# EAGLE design FlightController3 (EAGLE 8.4.0)

## Sheet 1 of 4: Main
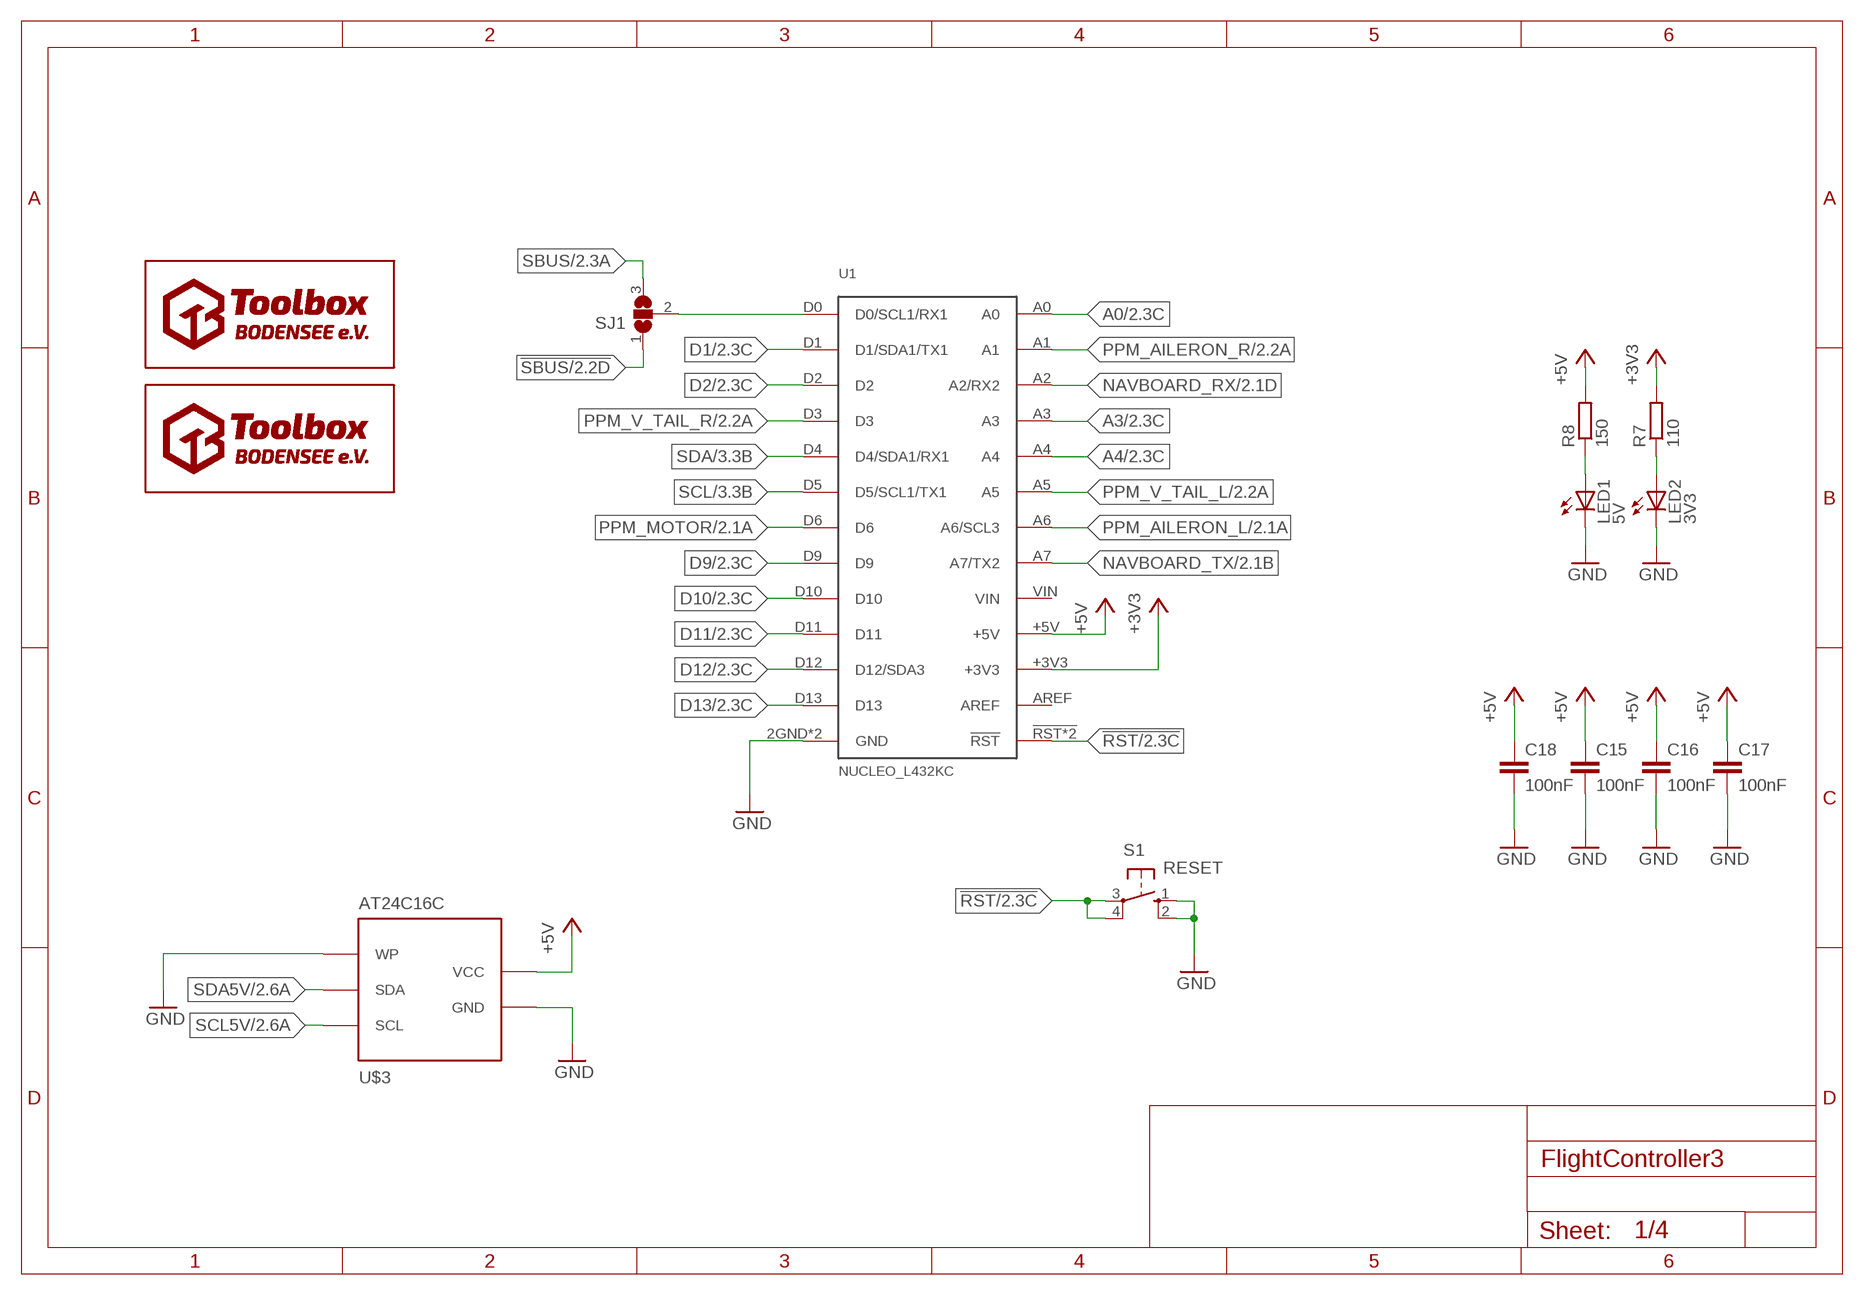
[diagram p0: schematic, sheet 1]

### Parts
C15  100nF  C-EUC1206  [C1206]
C16  100nF  C-EUC1206  [C1206]
C17  100nF  C-EUC1206  [C1206]
C18  100nF  C-EUC1206  [C1206]
LED1  5V  LEDSML0603  [SML0603]
LED2  3V3  LEDSML0603  [SML0603]
R7  110  R-EU_M1206  [M1206]
R8  150  R-EU_M1206  [M1206]
S1  RESET  10-XX  [B3F-10XX]
SJ1  SJ2W  [SJ_2]
U1  NUCLEO_L432KC  [NUCLEO]
U$1  TOOLBOX_LOGO  [TOOLBOX]
U$2  TOOLBOX_LOGO  [TOOLBOX]
U$3  AT24C16C  [DIL08]

### Nets
!RST: S1.3(P) S1.4(P1) U1.2!RST(!RST) U1.!RST ; also sheet 2
!SBUS: SJ1.1 ; also sheet 2,3
+3V3: R7.2 U1.+3V3 ; also sheet 2,3
+5V: C15.1 C16.1 C17.1 C18.1 R8.2 U1.+5V U$3.8(VCC) ; also sheet 2,3,4
A0: U1.A0 ; also sheet 2
A3: U1.A3 ; also sheet 2
A4: U1.A4 ; also sheet 2
D1: U1.D1(D1/SDA1/TX1) ; also sheet 2
D2: U1.D2 ; also sheet 2
D9: U1.D9 ; also sheet 2
D10: U1.D10 ; also sheet 2
D11: U1.D11 ; also sheet 2
D12: U1.D12(D12/SDA3) ; also sheet 2
D13: U1.D13 ; also sheet 2
GND: C15.2 C16.2 C17.2 C18.2 LED1.C LED2.C S1.1(S) S1.2(S1) U1.2GND(GND) U1.GND U$3.4(GND) U$3.7(WP) ; also sheet 2,3,4
N$2: LED2.A R7.1
N$3: LED1.A R8.1
N$10: SJ1.2 U1.D0(D0/SCL1/RX1)
NAVBOARD_RX: U1.A2(A2/RX2) ; also sheet 2
NAVBOARD_TX: U1.A7(A7/TX2) ; also sheet 2
PPM_AILERON_L: U1.A6(A6/SCL3) ; also sheet 2
PPM_AILERON_R: U1.A1 ; also sheet 2
PPM_MOTOR: U1.D6 ; also sheet 2
PPM_V_TAIL_L: U1.A5 ; also sheet 2
PPM_V_TAIL_R: U1.D3 ; also sheet 2
SBUS: SJ1.3 ; also sheet 2,3
SCL: U1.D5(D5/SCL1/TX1) ; also sheet 3
SCL5V: U$3.6(SCL) ; also sheet 2,3,4
SDA: U1.D4(D4/SDA1/RX1) ; also sheet 3
SDA5V: U$3.5(SDA) ; also sheet 2,3,4
Unconnected: U1.AREF

## Sheet 2 of 4: Connectors
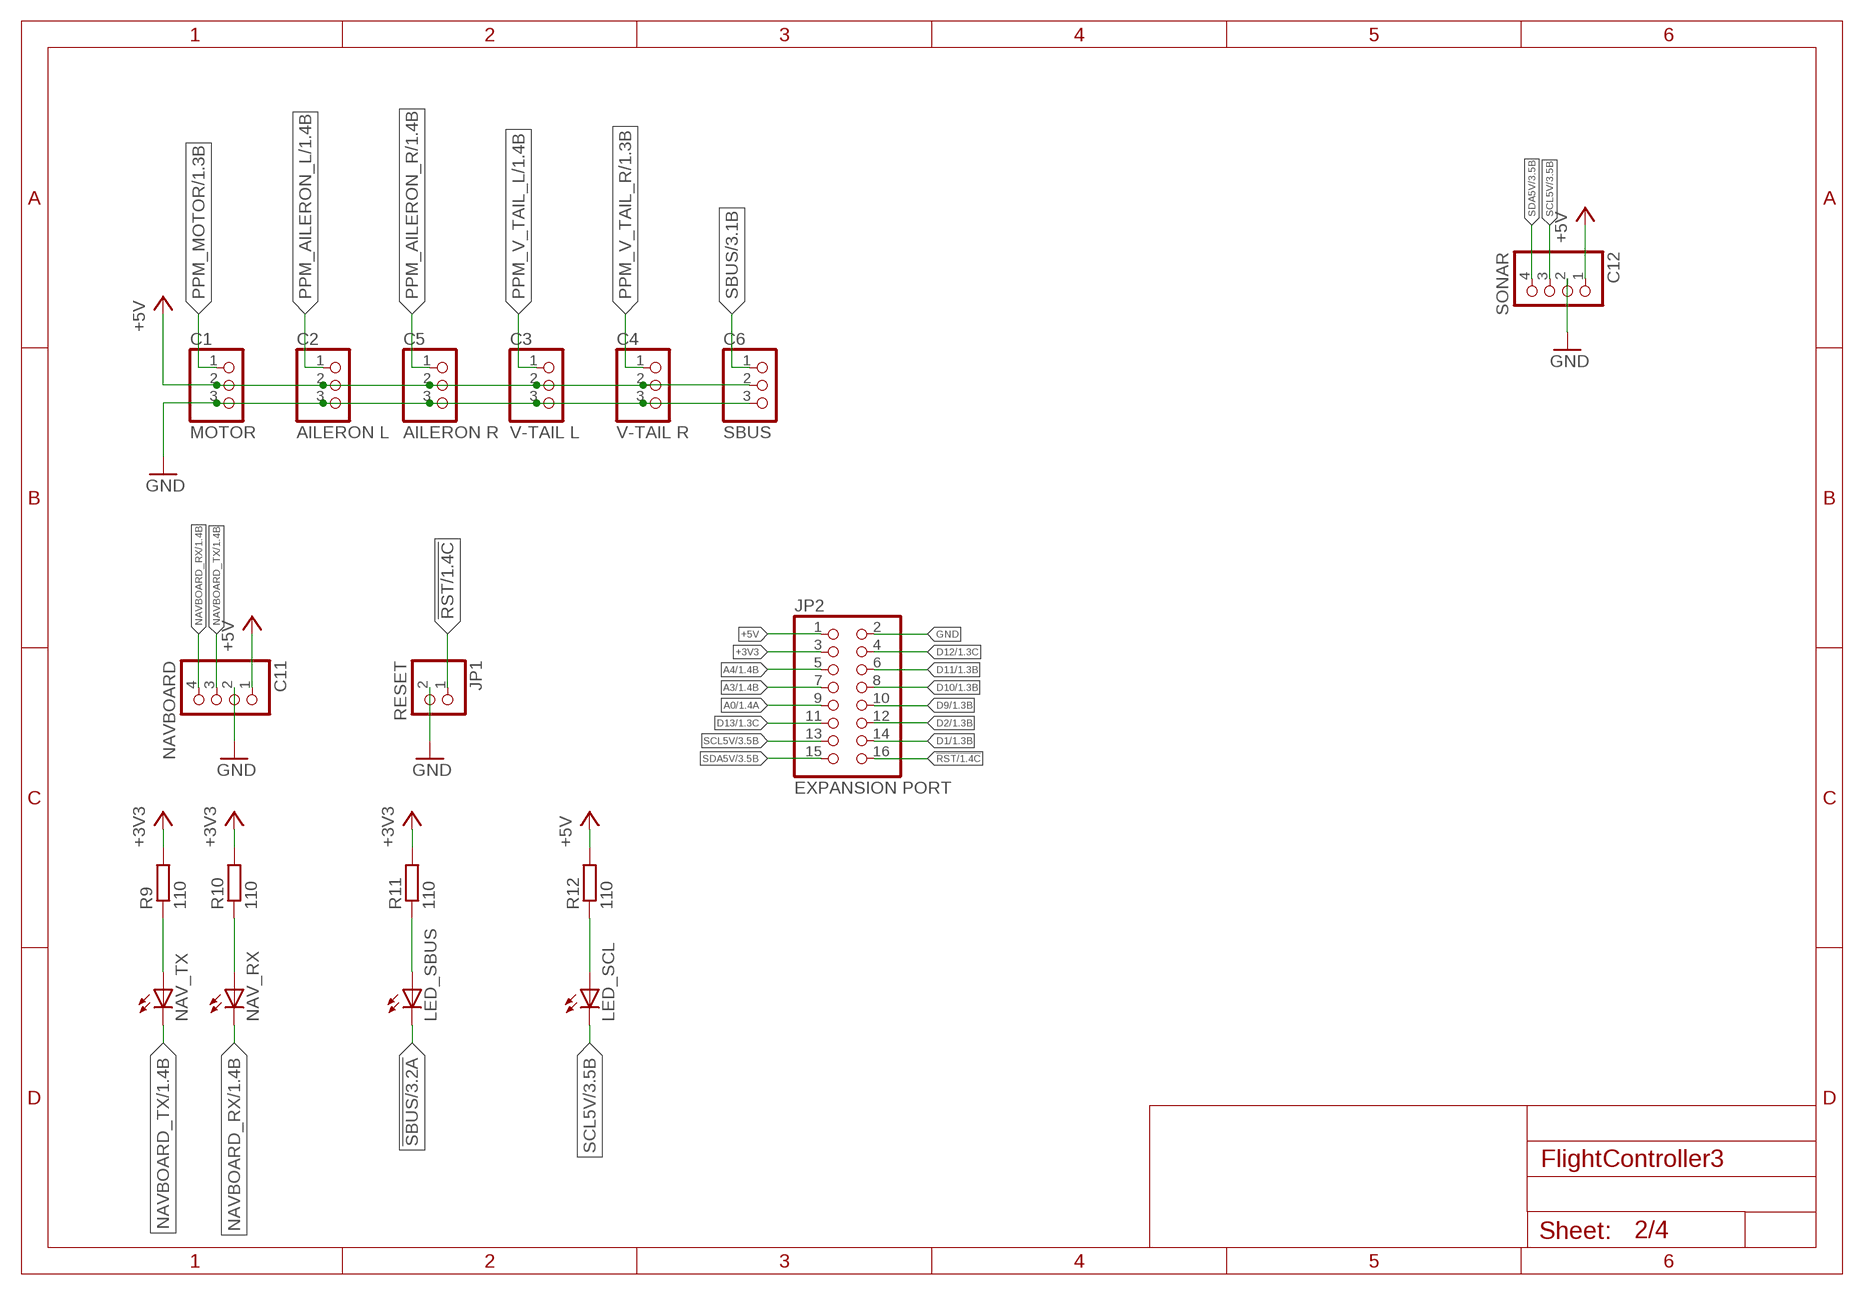
[diagram p1: schematic, sheet 2]

### Parts
C1  MOTOR  PINHD-1X3  [1X03]
C2  AILERON L  PINHD-1X3  [1X03]
C3  V-TAIL L  PINHD-1X3  [1X03]
C4  V-TAIL R  PINHD-1X3  [1X03]
C5  AILERON R  PINHD-1X3  [1X03]
C6  SBUS  PINHD-1X3  [1X03]
C11  NAVBOARD  PINHD-1X4  [1X04]
C12  SONAR  PINHD-1X4  [1X04]
JP1  RESET  PINHD-1X2  [1X02]
JP2  EXPANSION PORT  PINHD-2X8  [2X08]
LED_SBUS  LEDSML0603  [SML0603]
LED_SCL  LEDSML0603  [SML0603]
NAV_RX  LEDSML0603  [SML0603]
NAV_TX  LEDSML0603  [SML0603]
R9  110  R-EU_M1206  [M1206]
R10  110  R-EU_M1206  [M1206]
R11  110  R-EU_M1206  [M1206]
R12  110  R-EU_M1206  [M1206]

### Nets
!RST: JP1.1 JP2.16 ; also sheet 1
!SBUS: LED_SBUS.C ; also sheet 1,3
+3V3: JP2.3 R9.2 R10.2 R11.2 ; also sheet 1,3
+5V: C1.2 C2.2 C3.2 C4.2 C5.2 C6.2 C11.1 C12.1 JP2.1 R12.2 ; also sheet 1,3,4
A0: JP2.9 ; also sheet 1
A3: JP2.7 ; also sheet 1
A4: JP2.5 ; also sheet 1
D1: JP2.14 ; also sheet 1
D2: JP2.12 ; also sheet 1
D9: JP2.10 ; also sheet 1
D10: JP2.8 ; also sheet 1
D11: JP2.6 ; also sheet 1
D12: JP2.4 ; also sheet 1
D13: JP2.11 ; also sheet 1
GND: C1.3 C2.3 C3.3 C4.3 C5.3 C6.3 C11.2 C12.2 JP1.2 JP2.2 ; also sheet 1,3,4
N$4: NAV_TX.A R9.1
N$5: NAV_RX.A R10.1
N$6: LED_SBUS.A R11.1
N$7: LED_SCL.A R12.1
NAVBOARD_RX: C11.4 NAV_RX.C ; also sheet 1
NAVBOARD_TX: C11.3 NAV_TX.C ; also sheet 1
PPM_AILERON_L: C2.1 ; also sheet 1
PPM_AILERON_R: C5.1 ; also sheet 1
PPM_MOTOR: C1.1 ; also sheet 1
PPM_V_TAIL_L: C3.1 ; also sheet 1
PPM_V_TAIL_R: C4.1 ; also sheet 1
SBUS: C6.1 ; also sheet 1,3
SCL5V: C12.3 JP2.13 LED_SCL.C ; also sheet 1,3,4
SDA5V: C12.4 JP2.15 ; also sheet 1,3,4

## Sheet 3 of 4: Signal
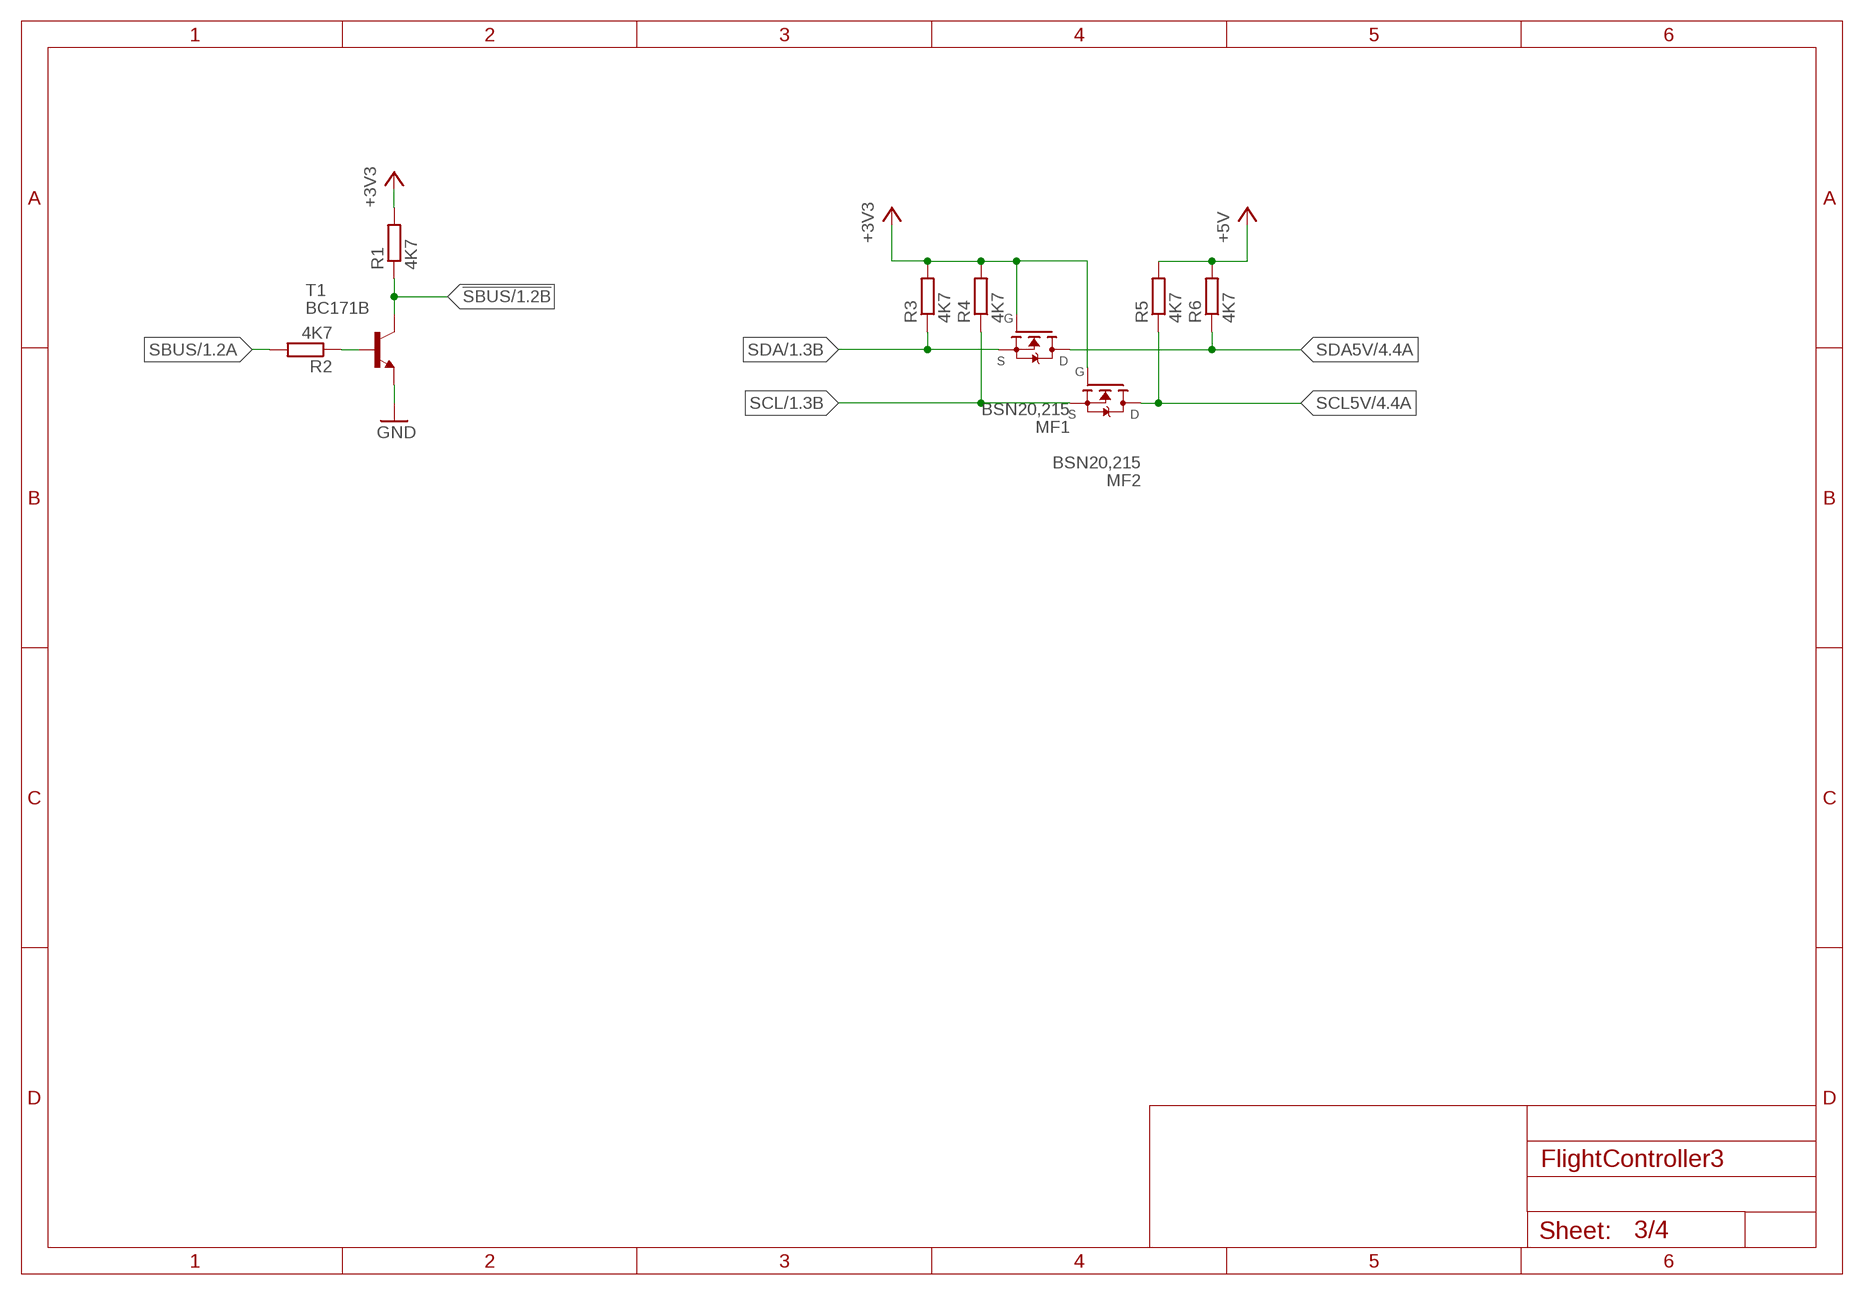
[diagram p2: schematic, sheet 3]

### Parts
MF1  BSN20,215  [BSN20_215]
MF2  BSN20,215  [BSN20_215]
R1  4K7  R-EU_R0603  [R0603]
R2  4K7  R-EU_R0603  [R0603]
R3  4K7  R-EU_R0603  [R0603]
R4  4K7  R-EU_R0603  [R0603]
R5  4K7  R-EU_R0603  [R0603]
R6  4K7  R-EU_R0603  [R0603]
T1  BC171B  -NPN-TO92  [TO92]

### Nets
!SBUS: R1.1 T1.3(C) ; also sheet 1,2
+3V3: MF1.1(G) MF2.1(G) R1.2 R3.2 R4.2 ; also sheet 1,2
+5V: R5.2 R6.2 ; also sheet 1,2,4
GND: T1.1(E) ; also sheet 1,2,4
N$1: R2.1 T1.2(B)
SBUS: R2.2 ; also sheet 1,2
SCL: MF2.2(S) R4.1 ; also sheet 1
SCL5V: MF2.3(D) R5.1 ; also sheet 1,2,4
SDA: MF1.2(S) R3.1 ; also sheet 1
SDA5V: MF1.3(D) R6.1 ; also sheet 1,2,4

## Sheet 4 of 4: Sensors
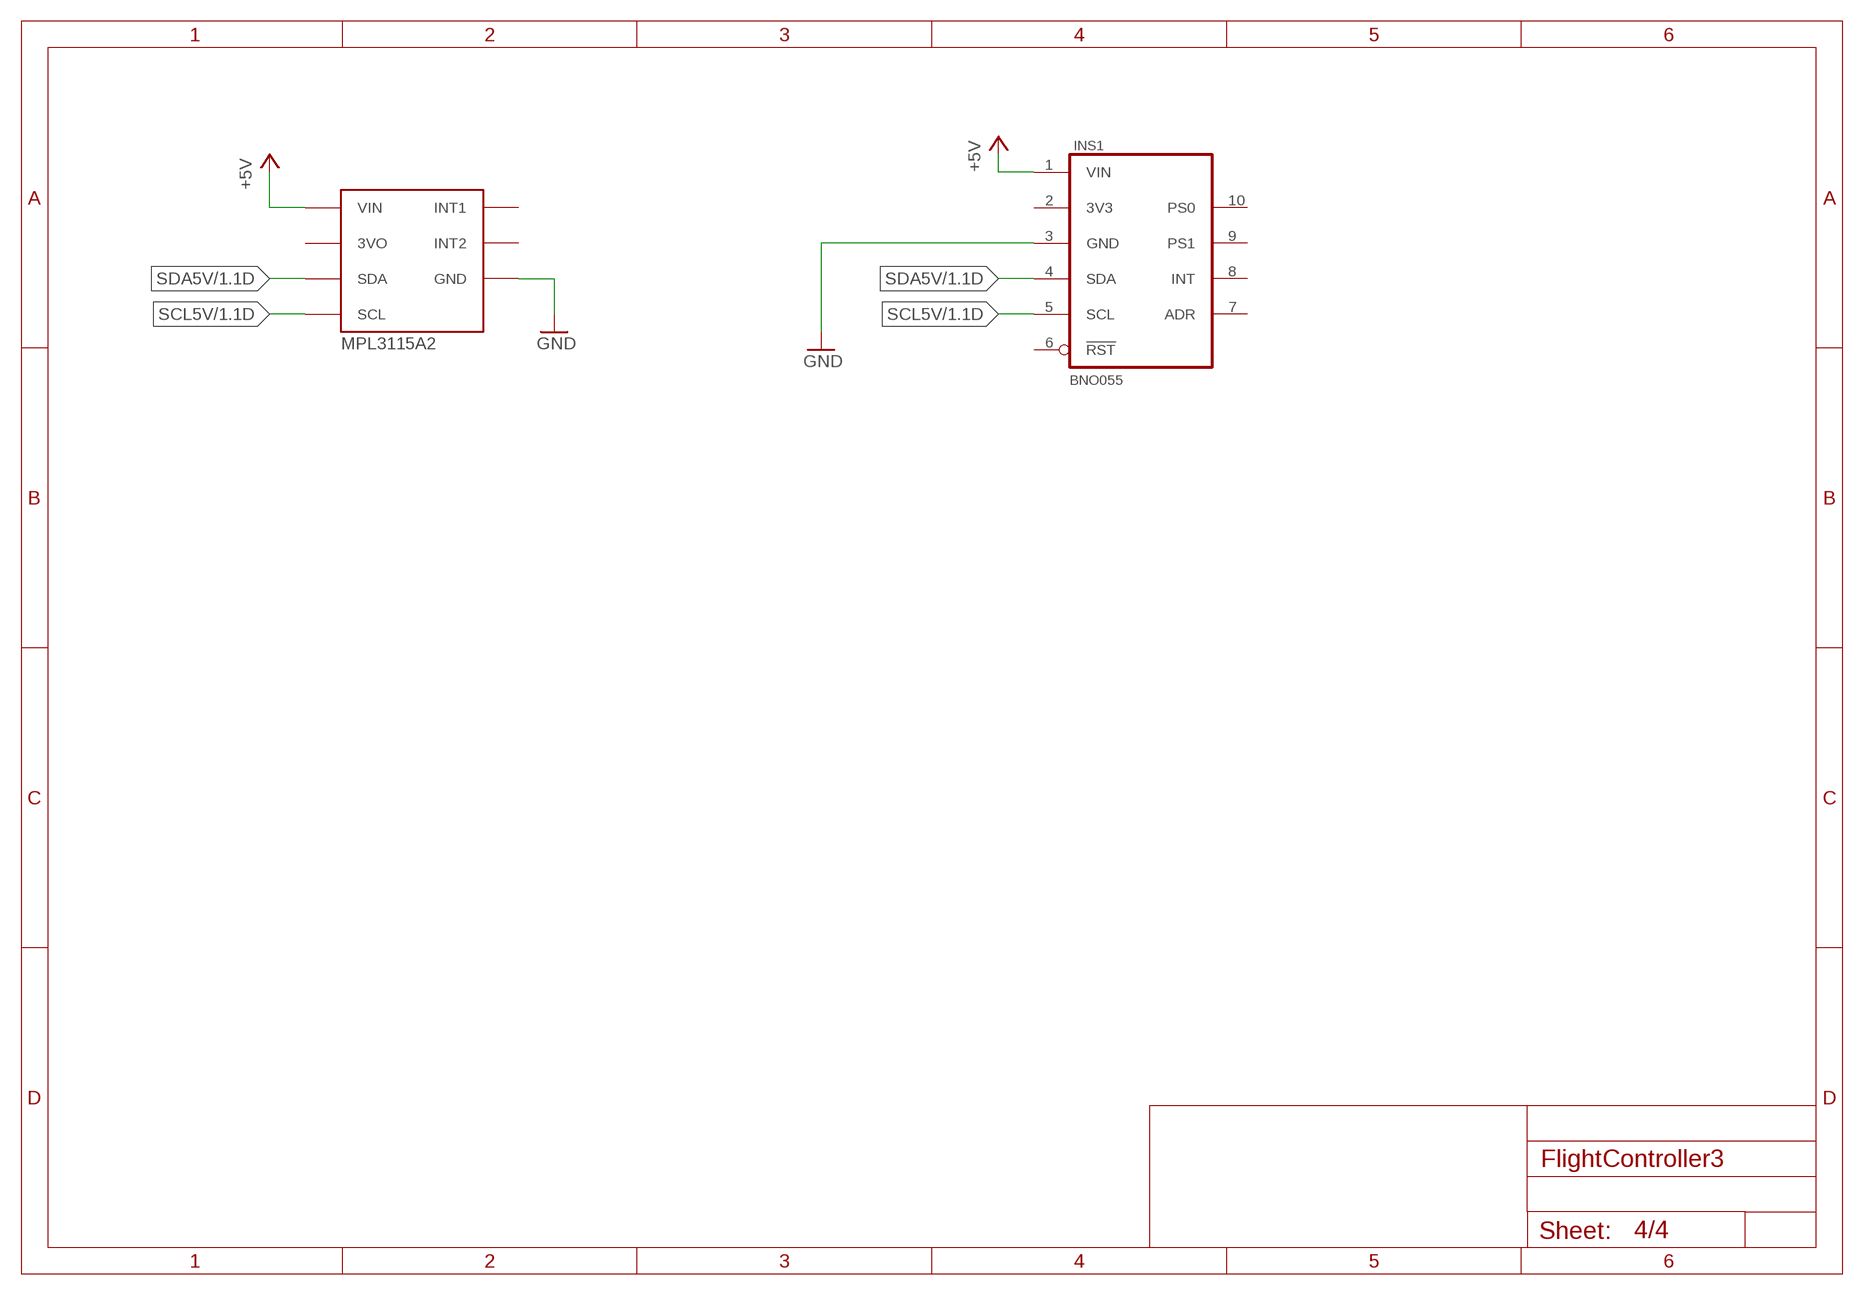
[diagram p3: schematic, sheet 4]

### Parts
INS1  BNO055  BNO055-BREAKOUT  [BNO055-BREAKOUT]
U$4  MPL3115A2  [MPL3115A2]

### Nets
+5V: INS1.1(VIN) U$4.VIN ; also sheet 1,2,3
GND: INS1.3(GND) U$4.GND ; also sheet 1,2,3
SCL5V: INS1.5(SCL) U$4.SCL ; also sheet 1,2,3
SDA5V: INS1.4(SDA) U$4.SDA ; also sheet 1,2,3
Unconnected: INS1.2(3V3) INS1.6(!RST) INS1.7(ADR) INS1.8(INT) INS1.9(PS1) INS1.10(PS0) U$4.3VO U$4.INT1 U$4.INT2

## Power pins joined to a net without a drawn wire
VIN: U1.VIN

## Library data of the parts
C1-C6 = pinhead:PINHD-1X3: PIN HEADER
C11 C12 = pinhead:PINHD-1X4: PIN HEADER
C15-C18 = resistor:C-EU: CAPACITOR, European symbol; SPICEPREFIX: C
INS1 = 1_Robo-Lib:BNO055-BREAKOUT: BNO055-Breakout
JP1 = pinhead:PINHD-1X2: PIN HEADER
JP2 = pinhead:PINHD-2X8: PIN HEADER
LED1 LED2 LED_SBUS LED_SCL NAV_RX NAV_TX = led:LED: LED OSRAM: - CHIPLED LG R971, LG N971, LY N971, LG Q971, LY Q971, LO R971, LY R971 LH N974, LH R974 LS Q976, LO Q976, LY Q976 LO Q996 - Hyper CHIPLED LW Q18S LB Q993, LB Q99A, LB R99A - SideLED LS A670, LO A670, LY A670, LG A670, LP A670 LB A673, LV A673, LT A673, LW A673 LH A674 LY A675 LS A676, LA A676, LO A676, LY A676, LW A676 LS A679, LY A679, LG A679 - Hyper Micro SIDELED® LS Y876, LA Y876, LO Y876, LY Y876 LT Y87S - SmartLED LW L88C, LW L88S LB L89C, LB L89S, LG L890 LS L89K, LO L89K, LY L89K LS L896, LA L896, LO L896, LY L896 - TOPLED LS T670, LO T670, LY T670, LG T670, LP T670 LSG T670, LSP T670, LSY T670, LOP T670, LYG T670 LG T671, LOG T671, LSG T671 LB T673, LV T673, LT T673, LW T673 LH T674 LS T676, LA T676, LO T676, LY T676, LB T676, LH T676, LSB T676, LW T676 LB T67C, LV T67C, LT T67C, LS T67K, LO T67K, LY T67K, LW E67C LS E67B, LA E67B, LO E67B, LY E67B, LB E67C, LV E67C, LT E67C LW T67C LS T679, LY T679, LG T679 LS T770, LO T770, LY T770, LG T770, LP T770 LB T773, LV T773, LT T773, LW T773 LH T774 LS E675, LA E675, LY E675, LS T675 LS T776, LA T776, LO T776, LY T776, LB T776 LHGB T686 LT T68C, LB T68C - Hyper Mini TOPLED® LB M676 - Mini TOPLED Santana® LG M470 LS M47K, LO M47K, LY M47K Source: http://www.osram.convergy.de LUXEON: - LUMILED® LXK2-PW12-R00, LXK2-PW12-S00, LXK2-PW14-U00, LXK2-PW14-V00 LXK2-PM12-R00, LXK2-PM12-S00, LXK2-PM14-U00 LXK2-PE12-Q00, LXK2-PE12-R00, LXK2-PE12-S00, LXK2-PE14-T00, LXK2-PE14-U00 LXK2-PB12-K00, LXK2-PB12-L00, LXK2-PB12-M00, LXK2-PB14-N00, LXK2-PB14-P00, LXK2-PB14-Q00 LXK2-PR12-L00, LXK2-PR12-M00, LXK2-PR14-Q00, LXK2-PR14-R00 LXK2-PD12-Q00, LXK2-PD12-R00, LXK2-PD12-S00 LXK2-PH12-R00, LXK2-PH12-S00 LXK2-PL12-P00, LXK2-PL12-Q00, LXK2-PL12-R00 Source: www.luxeon.com KINGBRIGHT: KA-3528ASYC Source: www.kingbright.com; SPICEMODEL: SMLD12U8W; SPICEPREFIX: D
MF1 MF2 = BSN20_215:BSN20,215: BSN20 N chan with source-drain diode handy for I2C voltage shifter; AVAILABILITY: Good; DESCRIPTION: BSN Series 50 V 15 Ohm 0.83 W N-Channel Enhancement Mode Transistor - SOT-23; MF: NXP Semiconductors; MP: BSN20,215; PACKAGE: TO-236 NXP Semiconductors; PRICE: 0.17 USD; SPICEMODEL: BSN20; SPICEPREFIX: X
R1-R8 = resistor:R-EU_: RESISTOR, European symbol; SPICEPREFIX: R
R9-R12 = rcl:R-EU_: RESISTOR, European symbol; SPICEPREFIX: R
S1 = switch-omron:10-XX: OMRON SWITCH; MPN: B3F-1000; OC_FARNELL: 176432; OC_NEWARK: 36M3542
SJ1 = jumper:SJ2W: SMD solder JUMPER
T1 = transistor:*-NPN-: NPN Transistror BF959 corrected 2008.03.06; SPICEMODEL: BC171B; SPICEPREFIX: Q
U1 = NUCLEO:NUCLEO_L432KC; SPICEMODEL: NUCLEO; SPICEPREFIX: X
U$1 U$2 = toolbox:TOOLBOX_LOGO
U$3 = JonasLib:AT24C16C; SPICEMODEL: AT24C16C; SPICEPREFIX: X
U$4 = MPL3115A2:MPL3115A2; ADAFRUIT_PRODUCT_ID: 1893

## Board
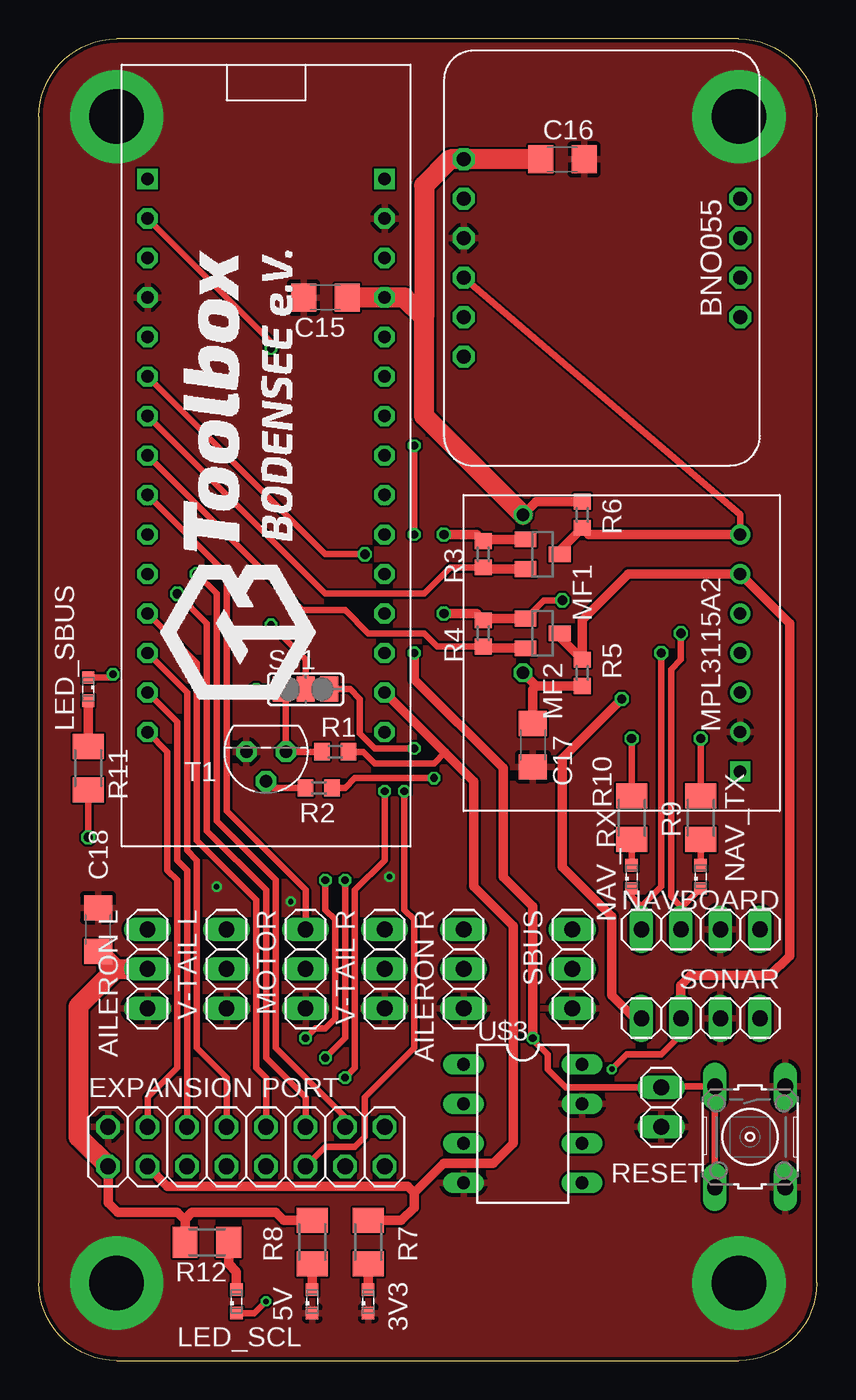
[diagram p4: board, top side]
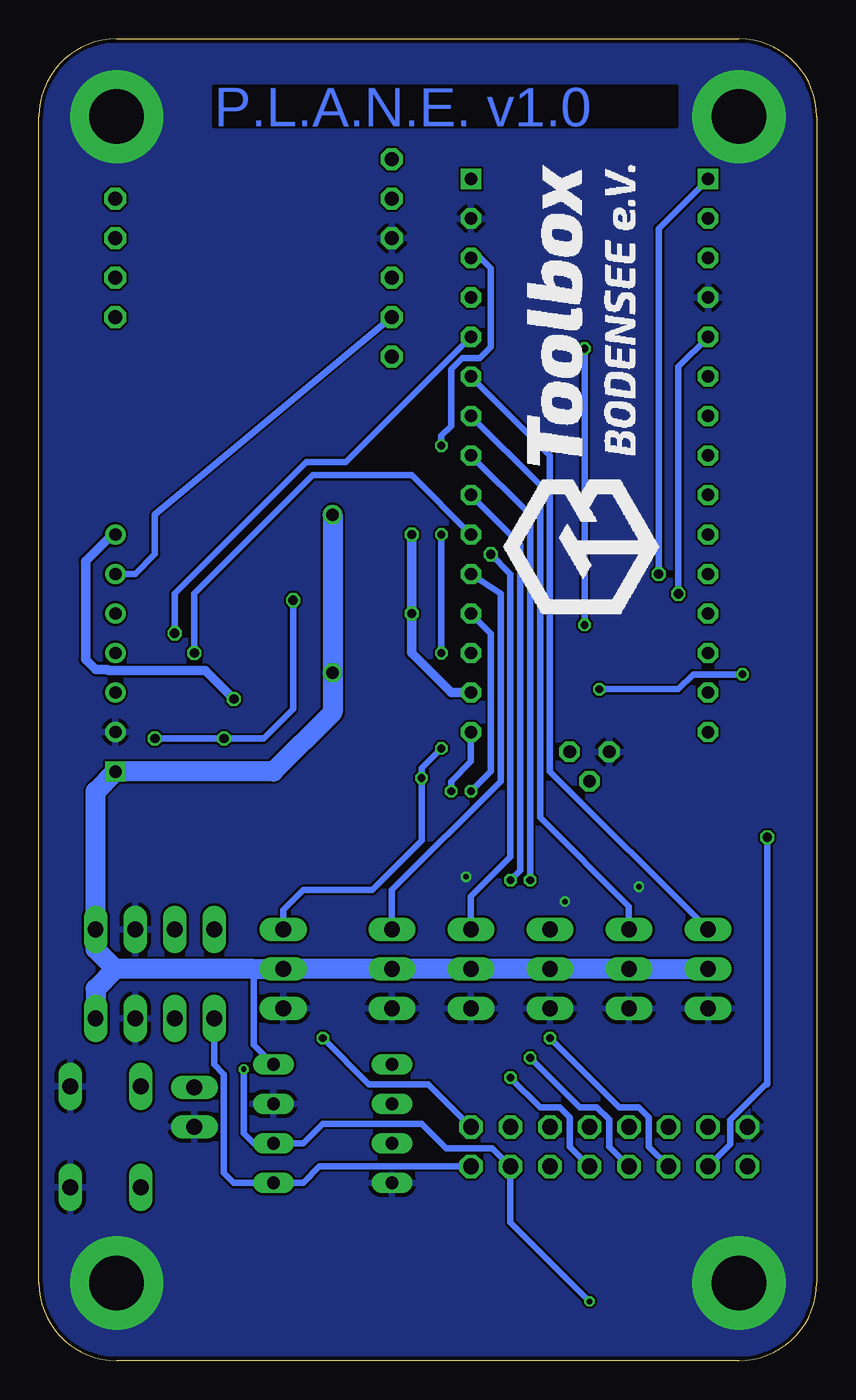
[diagram p5: board, bottom side, seen from below]

Size 50 x 85 mm. Coordinates in mm from the lower left corner, seen from the top.
Outline: 5,0 arc-90 0,5 0,80 arc-90 5,85 45,85 arc-90 50,80 50,5 arc-90 45,0 5,0
Copper layers (1*16): Top 0.035mm / dielectric 1.5mm / Bottom 0.035mm
Design rules "SeeedStudio_2layer_DRU_no_angle_20140221": minimum track width 6mil, minimum drill 12mil, track to track 6mil, track to pad 6mil, pad to pad 6mil, via to via 6mil, smd to smd 0mil, copper to edge 10mil, drill to drill 10mil, minimum pad ring 10mil, minimum via ring 6mil, stop-mask expansion 2mil, vias tented up to drill 100mil, thermal gap 10mil

### Footprints (pad centres in the part's own frame; a part is rotated, then mirrored left to right if it is on the bottom)
1X03 = drill 1.016 long: 1 -2.54,0; 2 0,0; 3 2.54,0
1X04 = drill 1.016 long: 1 -3.81,0; 2 -1.27,0; 3 1.27,0; 4 3.81,0
C1206 = smd 1.6 x 1.8: 1 -1.4,0; 2 1.4,0
BNO055-BREAKOUT = drill 0.9 octagon: 1 -6.35,-8.89; 2 -3.81,-8.89; 3 -1.27,-8.89; 4 1.27,-8.89; 5 3.81,-8.89; 6 6.35,-8.89; 7 3.81,8.89; 8 1.27,8.89; 9 -1.27,8.89; 10 -3.81,8.89
1X02 = drill 1.016 long: 1 -1.27,0; 2 1.27,0
2X08 = drill 1.016 octagon: 1 -8.89,-1.27; 2 -8.89,1.27; 3 -6.35,-1.27; 4 -6.35,1.27; 5 -3.81,-1.27; 6 -3.81,1.27; 7 -1.27,-1.27; 8 -1.27,1.27; 9 1.27,-1.27; 10 1.27,1.27; 11 3.81,-1.27; 12 3.81,1.27; 13 6.35,-1.27; 14 6.35,1.27; 15 8.89,-1.27; 16 8.89,1.27
SML0603 = smd 0.8 x 0.8: A 0.75,0; C -0.75,0
BSN20_215 = smd 1 x 1.4: 1 -0.95,-1.1; 2 0.95,-1.1; 3 0,1.1
R0603 = smd 1 x 1.1: 1 -0.85,0; 2 0.85,0
M1206 = smd 1.6 x 2: 1 -1.4,0; 2 1.4,0
B3F-10XX = drill 1.016 long: 1 -3.251,2.261; 2 3.251,2.261; 3 -3.251,-2.261; 4 3.251,-2.261
SJ_2 = smd 1.168 x 1.6: 1 -1.524,0; 2 0,0; 3 1.524,0
TO92 = drill 0.813 octagon: 1 1.27,0; 2 0,1.905; 3 -1.27,0
NUCLEO = drill 0.8 octagon: 2!RST 7.62,12.7; 2GND 7.62,15.24; !RST -7.62,12.7; +3V3 7.62,-15.24; +5V 7.62,10.16; A0 7.62,-10.16; A1 7.62,-7.62; A2 7.62,-5.08; A3 7.62,-2.54; A4 7.62,0; A5 7.62,2.54; A6 7.62,5.08; A7 7.62,7.62; AREF 7.62,-12.7; D0 -7.62,15.24; D2 -7.62,7.62; D3 -7.62,5.08; D4 -7.62,2.54; D5 -7.62,0; D6 -7.62,-2.54; D7 -7.62,-5.08; D8 -7.62,-7.62; D9 -7.62,-10.16; D10 -7.62,-12.7; D11 -7.62,-15.24; D12 -7.62,-17.78; D13 7.62,-17.78; GND -7.62,10.16 | drill 0.8 square: D1 -7.62,17.78; VIN 7.62,17.78
DIL08 = drill 0.813 long: 1 -3.81,-3.81; 2 -1.27,-3.81; 3 1.27,-3.81; 4 3.81,-3.81; 5 3.81,3.81; 6 1.27,3.81; 7 -1.27,3.81; 8 -3.81,3.81
MPL3115A2 = drill 0.8: 3VO -2.54,-7.62; GND -5.08,-7.62; INT1 2.54,-7.62; INT2 0,-7.62; SCL 5.08,-7.62; SDA 7.62,-7.62 | drill 0.8 square: VIN -7.62,-7.62

### Placement (x,y rotation side)
C1  17.14,25.18 270 top
C2  6.99,25.18 270 top
C3  12.06,25.18 270 top
C4  22.23,25.18 270 top
C5  27.3,25.18 270 top
C6  34.29,25.18 270 top
C11  42.55,27.73 180 top
C12  42.55,22.01 180 top
C15  18.41,68.36 180 top
C16  33.66,77.25 0 top
C17  31.75,39.59 270 top
C18  3.81,27.73 90 top
INS1  36.2,70.91 270 top
JP1  40.01,16.3 270 top
JP2  13.34,13.76 0 top
LED1  17.57,3.81 90 top
LED2  21.17,3.81 90 top
LED_SBUS  3.17,43.18 270 top
LED_SCL  12.7,3.81 90 top
MF1  32.38,51.85 270 top
MF2  32.38,46.77 270 top
NAV_RX  38.1,31.11 90 top
NAV_TX  42.55,31.11 90 top
R1  19.05,39.16 0 top
R2  18,36.83 0 top
R3  28.57,51.85 90 top
R4  28.57,46.77 90 top
R5  34.92,44.23 270 top
R6  34.92,54.4 90 top
R7  21.17,7.62 90 top
R8  17.57,7.62 90 top
R9  42.55,34.92 90 top
R10  38.1,34.92 90 top
R11  3.17,38.1 270 top
R12  10.79,7.62 180 top
S1  45.72,14.39 270 top
SJ1  17.14,43.18 0 top
T1  14.61,39.16 180 top
U1  14.61,58.2 0 top
U$1  17.78,42.55 90 top
U$2  10.16,48.05 90 bottom
U$3  31.11,15.24 270 top
U$4  37.47,45.51 90 top

### Tracks (layer width: path | path; a pad name or v marks a point on that pad's centre or on a via)
!RST  (via drill 0.5)
  Top 0.406: v24.13,53.12 v24.13,58.84 | S1.4 S1.3 40.08,17.64 JP1.1 33.87,17.57 32.7,18.73 32.7,19.68 31.75,20.64 v31.75,20.74
  Top 0.61: v31.75,20.74 31.75,29.21 29.84,31.11 29.84,38.1 24.13,43.81 v24.13,45.51
  Bottom 0.406: v24.13,58.84 24.13,59.48 23.5,60.11 23.5,63.77 22.78,64.48 21.67,64.48 20.95,65.19 20.95,70.27 21.59,70.91 U1.2!RST | v24.13,45.51 v24.13,53.12 | v31.75,20.74 28.79,17.78 24.98,17.78 JP2.16
!SBUS  (via drill 0.5)
  Top 0.406: R1.1 T1.3 15.88,42.93 SJ1.1 v13.97,43.18 | v4.76,44.13 4.56,43.93 LED_SBUS.C
  Bottom 0.406: v13.97,43.18 8.89,43.18 7.94,44.13 v4.76,44.13
+3V3  (via drill 0.6)
  Top 0.406: R11.2 v3.17,33.66 | v38.1,40.01 R10.2 | v33.66,48.9 32.45,48.9 MF2.1 | 26.09,39.1 25.4,38.42 21.59,38.42 20.85,39.16 R1.2 | R9.2 v42.55,40.01
  Top 0.61: MF1.1 28.57,52.8 R3.2 28.16,53.12 v26.04,53.12 | MF2.1 28.57,47.73 R4.2 28.16,48.05 v26.04,48.05 | JP2.3 8.26,11.21 23.71,11.21 24.13,10.79 | U1.+3V3 26.09,39.1 27.94,37.25 27.94,30.48 30.48,27.94 30.48,13.97 29.21,12.7 26.04,12.7 24.13,10.79 | R7.2 23.31,9.02 24.13,9.84 24.13,10.79
  Bottom 0.406: v3.17,33.66 3.17,17.78 3.27,17.78 5.56,15.49 5.56,13.91 JP2.3 | v42.55,40.01 v38.1,40.01 35.56,40.01 33.66,41.91 v33.66,48.9
  Bottom 0.61: v26.04,53.12 v26.04,48.05 26.04,45.51 23.5,42.97 U1.+3V3
+5V  (via drill 0.8)
  Top 0.61: v31.11,54.4 31.96,55.24 R6.2 | 31.96,43.38 v31.11,44.23 | 31.96,43.38 R5.2 33.52,43.38 | C17.1 31.75,43.17 31.96,43.38 | JP2.1 4.45,10.16 5.08,9.53 8.89,9.53 9.39,9.02 R12.2 9.39,9.08 9.84,9.53 15.24,9.53 15.74,9.02 R8.2
  Top 1.27: 24.77,67.09 23.5,68.36 U1.+5V C15.1 | v31.11,54.4 24.77,60.74 24.77,67.09 | C16.1 INS1.1 26.45,77.25 24.77,75.56 24.77,67.09 | 4.95,25.18 C2.2 | 4.95,25.18 C18.1 | JP2.1 2.54,14.39 2.54,22.77 4.95,25.18
  Bottom 0.406: U$3.8 36.2,20.32 36.2,25.18
  Bottom 0.61: 35.14,38.1 34.92,37.88
  Bottom 1.27: C2.2 C3.2 C1.2 C4.2 C5.2 C6.2 36.2,25.18 45.09,25.18 | 45.09,25.18 46.35,26.45 C11.1 46.35,36.62 U$4.VIN 34.92,37.88 31.11,41.7 v31.11,44.23 v31.11,54.4 | C12.1 46.35,23.91 45.09,25.18
A0  (via drill 0.5)
  Top 0.406: v22.23,36.62 22.23,32.17 20.32,30.27 20.32,18.84 v19.68,18.2
  Bottom 0.406: U1.A0 20.95,46.77 20.95,37.88 v22.23,36.62 | v19.68,18.2 17.78,16.3 16.51,16.3 15.88,15.66 15.88,13.76 JP2.9
A3  (via drill 0.5)
  Top 0.406: v19.68,30.9 19.68,20.74 v18.41,19.47
  Bottom 0.406: U1.A3 19.05,52.49 19.05,31.54 v19.68,30.9 | v18.41,19.47 15.24,16.3 14.12,16.3 13.34,15.51 13.34,13.76 JP2.7
A4  (via drill 0.5)
  Top 0.406: v18.41,30.9 18.41,29 19.05,28.36 19.05,22.01 18.41,21.38 17.78,21.38 v17.14,20.74
  Bottom 0.406: U1.A4 18.41,54.4 v18.41,30.9 | v17.14,20.74 12.7,16.3 11.43,16.3 10.79,15.66 10.79,13.76 JP2.5
D1  (via drill 0.6)
  Top 0.406: v10.16,50.59 11.43,49.31 11.43,34.71 15.24,30.9 15.24,20.11 19.68,15.66 JP2.14
  Bottom 0.406: U1.D1 10.16,72.81 v10.16,50.59
D2  (via drill 0.6)
  Top 0.406: v8.89,49.31 10.79,47.41 10.79,34.08 14.61,30.27 14.61,19.47 17.14,16.93 JP2.12
  Bottom 0.406: U1.D2 8.89,63.92 v8.89,49.31
D9
  Top 0.406: U1.D9 10.16,44.87 10.16,33.44 13.97,29.63 13.97,18.84 14.61,18.2 JP2.10
D10
  Top 0.406: U1.D10 9.53,42.97 9.53,32.8 10.16,32.17 10.16,20.11 12.06,18.2 JP2.8
D11
  Top 0.406: U1.D11 8.89,41.06 8.89,32.17 9.53,31.54 JP2.6
D12
  Top 0.406: U1.D12 8.26,39.16 8.26,31.54 8.89,30.9 8.89,18.84 6.99,16.93 JP2.4
D13  (via drill 0.5)
  Top 0.406: v23.5,36.62 23.5,29 24.13,28.36 24.13,20.11 20.95,16.93 20.95,14.39 20.32,13.76 18.41,13.76 JP2.11
  Bottom 0.406: U1.D13 22.23,38.52 23.5,37.25 v23.5,36.62
GND  (via drill 0.35, 3.5 pad 6)
  other vias: 5,80 45,80 5,5 45,5 11.43,30.48 16.19,29.53 22.54,31.11
  pour Top: 0.1,84.9 49.9,84.9 49.9,0.1 0.1,0.1
  pour Bottom: 0.1,84.9 49.9,84.9 49.9,0.1 0.1,0.1
N$1
  Top 0.406: T1.2 15.03,36.83 R2.1
N$2
  Top 0.61: LED2.A R7.1
N$3
  Top 0.61: R8.1 LED1.A
N$4
  Top 0.406: R9.1 NAV_TX.A
N$5
  Top 0.406: R10.1 NAV_RX.A
N$6
  Top 0.61: LED_SBUS.A R11.1
N$7
  Top 0.61: LED_SCL.A 12.7,5.71 12.2,6.22 R12.1
N$10  (via drill 0.5)
  Top 0.406: SJ1.2 17.14,45.09 v14.92,47.31 | U1.D0 14.92,65.51 v14.92,65.09
  Bottom 0.406: v14.92,47.31 v14.92,65.09
NAVBOARD_RX  (via drill 0.6)
  Top 0.406: 38.73,29.21 C11.4 | 38.73,29.21 40.01,30.48 v40.01,45.51 | NAV_RX.C 38.1,29.84 38.73,29.21
  Bottom 0.406: v40.01,45.51 40.01,49.31 32.38,56.94 26.04,56.94 U1.A2
NAVBOARD_TX  (via drill 0.6)
  Top 0.406: NAV_TX.C 41.27,29.09 C11.3 41.27,29.21 40.64,29.84 40.64,44.45 41.27,45.09 v41.27,46.77
  Bottom 0.406: v41.27,46.77 41.27,49.31 32.8,57.79 30.26,57.79 U1.A7
PPM_AILERON_L
  Bottom 0.406: C2.1 17.14,37.88 17.14,58.2 U1.A6
PPM_AILERON_R
  Bottom 0.406: U1.A1 20.32,49.31 20.32,38.73 20.32,37.25 27.3,30.27 C5.1
PPM_MOTOR
  Top 0.406: U1.D6 12.06,50.59 12.06,35.34 17.14,30.27 C1.1
PPM_V_TAIL_L
  Bottom 0.406: U1.A5 17.78,56.3 17.78,34.92 12.06,29.21 C3.1
PPM_V_TAIL_R  (via drill 0.6)
  Top 0.406: U1.D3 18.41,51.85 v20.95,51.85
  Bottom 0.406: v20.95,51.85 19.68,50.59 19.68,32.38 22.23,29.84 C4.1
SBUS  (via drill 0.5)
  Top 0.406: R2.2 19.68,36.83 20.32,37.47 v25.4,37.47 | v24.13,39.37 21.59,39.37 20.64,40.32 20.64,42.55 20,43.18 SJ1.3
  Bottom 0.406: C6.1 34.29,29 33.02,30.27 28.57,30.27 25.4,33.44 v25.4,37.47 25.4,38.1 24.45,39.05 v24.13,39.37
SCL
  Top 0.406: R4.1 25.61,45.92 24.77,46.77 21.17,46.77 19.68,48.26 16.93,48.26 U1.D5
  Top 0.61: MF2.2 28.57,45.83 R4.1
SCL5V  (via drill 0.35)
  Top 0.406: C12.3 41.27,20.95 40.01,19.68 37.78,19.68 v36.83,18.73 | LED_SCL.C 13.86,3.06 v14.61,3.81
  Top 0.61: MF2.3 33.48,46.52 R5.1 34.92,47.62 37.88,50.59 U$4.SCL 48.26,47.41 48.26,26.04 46.99,24.77 41.91,24.77 41.27,24.13 C12.3
  Bottom 0.406: U$4.SCL 43.81,50.59 42.55,51.85 42.55,54.4 INS1.5 | v36.83,18.73 36.83,14.61 36.2,13.97 U$3.6 33.02,13.97 31.75,15.24 25.4,15.24 23.81,13.65 20.85,13.65 JP2.13 19.68,8.89 v14.61,3.81
SDA
  Top 0.406: U1.D4 18.41,49.31 24.77,49.31 26.45,51.01 R3.1
  Top 0.61: MF1.2 28.57,50.91 R3.1
SDA5V  (via drill 0.6)
  Top 0.406: U$4.SDA 45.09,54.4 INS1.4
  Top 0.61: C12.4 38.31,22.01 36.83,23.5 36.83,28.57 33.66,31.75 33.66,38.73 v37.47,42.55 | U$4.SDA 35.34,53.12 R6.1 33.48,52.1 MF1.3
  Bottom 0.406: JP2.15 31.96,12.48 33.02,11.43 U$3.5 37.47,11.43 38.1,12.06 38.1,18.41 38.73,19.05 C12.4
  Bottom 0.61: U$4.SDA 45.3,53.12 46.99,51.44 46.99,45.09 46.35,44.45 45.6,44.45 45.55,44.39 39.31,44.39 v37.47,42.55

### Text on the board
Bottom: P.L.A.N.E. v1.0